# EAGLE design Hi Tension VGA Modulator (EAGLE 9.0.0)
CNAME: otsos.net; CREVISION: 2; DESIGNER: Otso Sorvettula
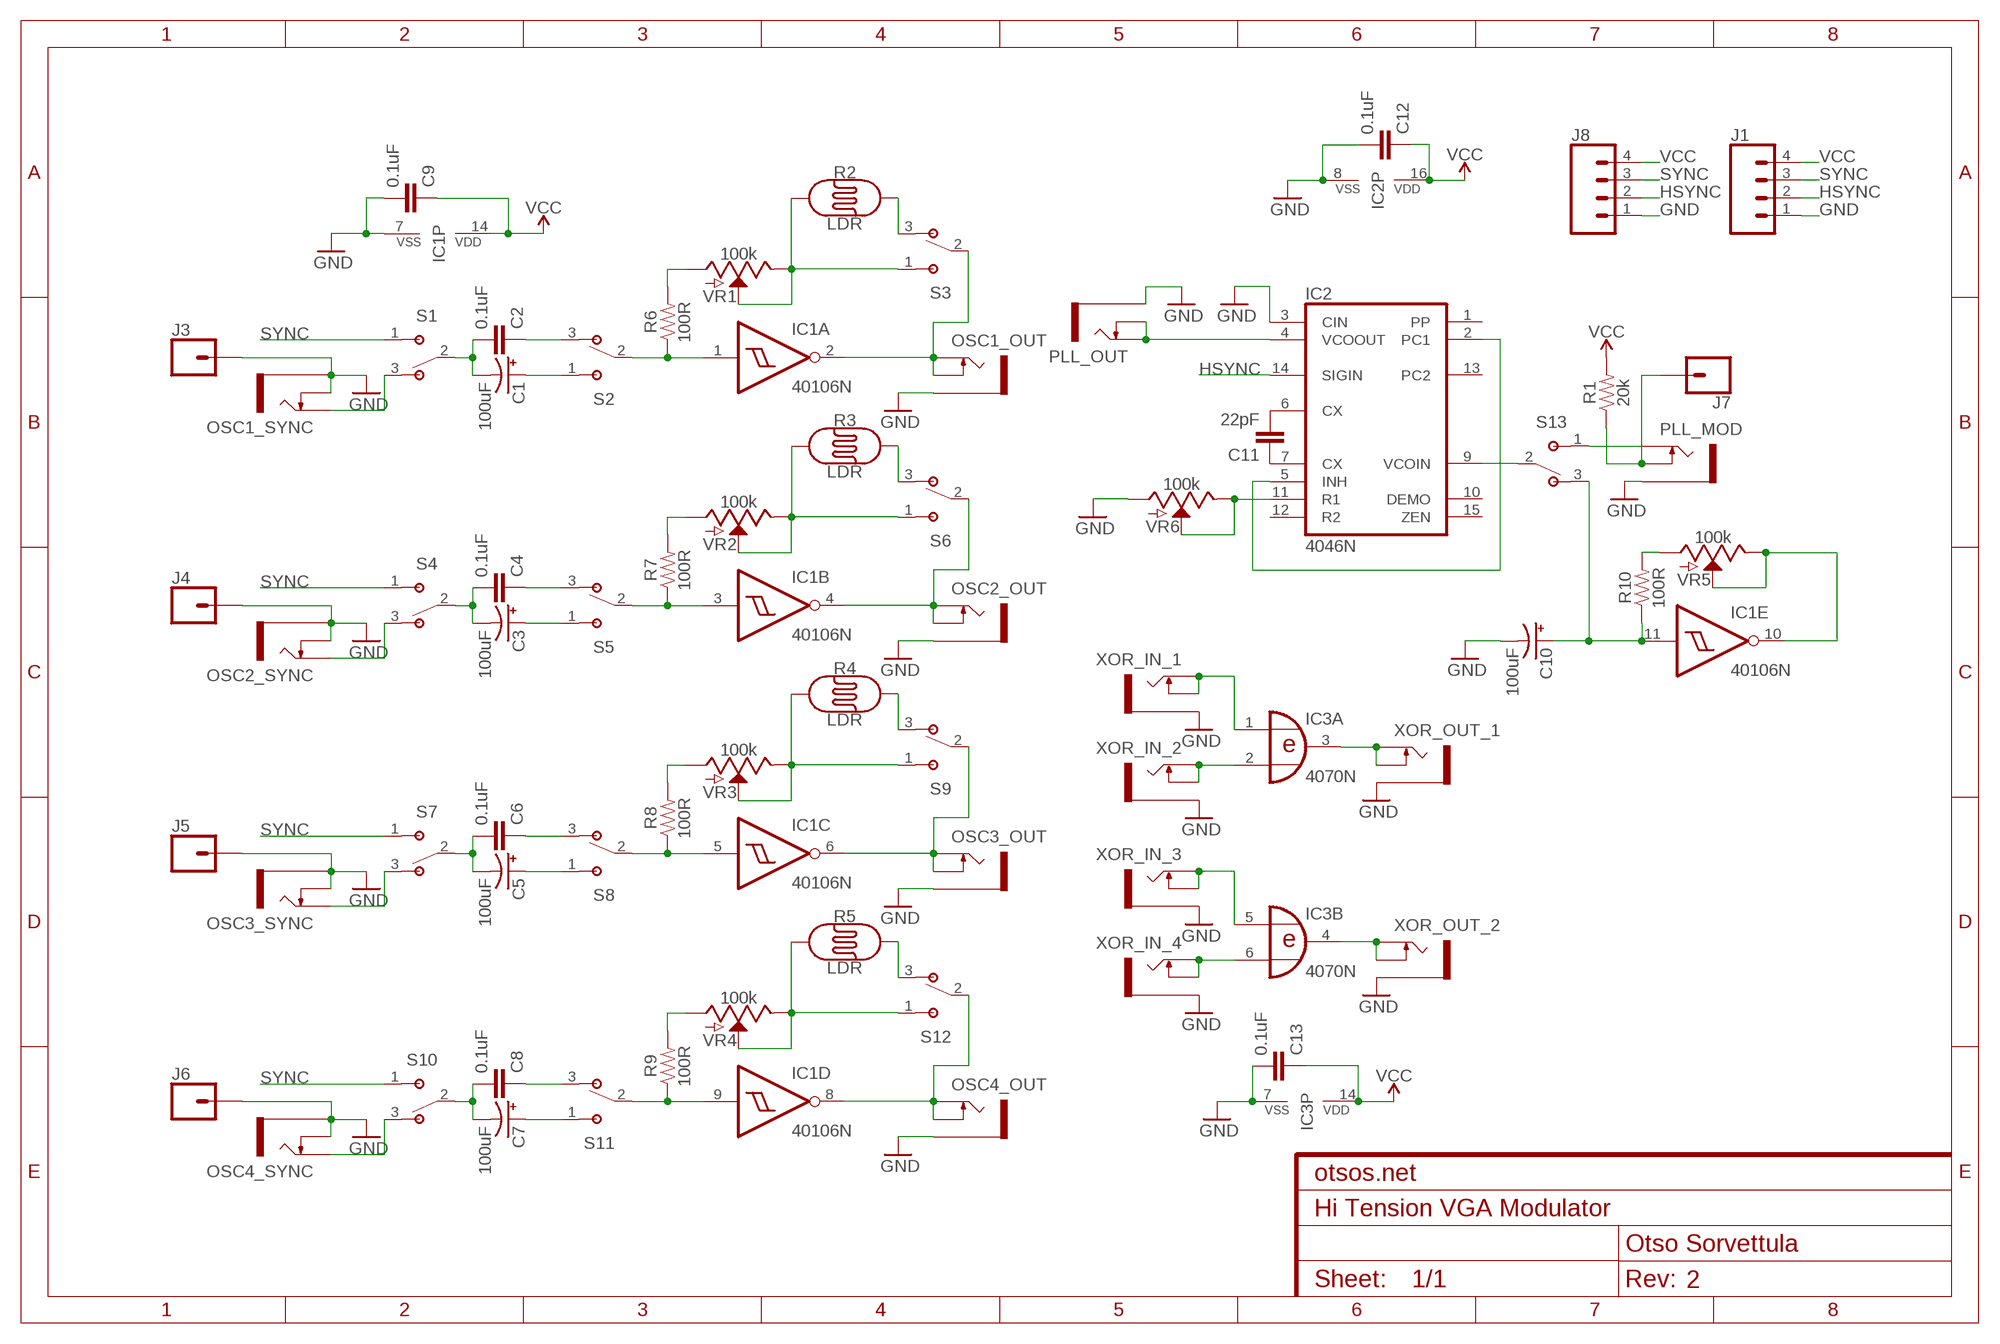
[diagram p0: schematic, sheet 1]

## Parts
C1  100uF  100UF-POLAR-RADIAL-2.5MM-25V-20%  [CPOL-RADIAL-2.5MM-6.5MM]
C2  0.1uF  C-EU025-025X050  [C025-025X050]
C3  100uF  100UF-POLAR-RADIAL-2.5MM-25V-20%  [CPOL-RADIAL-2.5MM-6.5MM]
C4  0.1uF  C-EU025-025X050  [C025-025X050]
C5  100uF  100UF-POLAR-RADIAL-2.5MM-25V-20%  [CPOL-RADIAL-2.5MM-6.5MM]
C6  0.1uF  C-EU025-025X050  [C025-025X050]
C7  100uF  100UF-POLAR-RADIAL-2.5MM-25V-20%  [CPOL-RADIAL-2.5MM-6.5MM]
C8  0.1uF  C-EU025-025X050  [C025-025X050]
C9  0.1uF  C-EU025-025X050  [C025-025X050]
C10  100uF  100UF-POLAR-RADIAL-2.5MM-25V-20%  [CPOL-RADIAL-2.5MM-6.5MM]
C11  22pF  22PF-PTH-2.54MM-200V-5%  [CAP-PTH-2.54]
C12  0.1uF  C-EU025-025X050  [C025-025X050]
C13  0.1uF  C-EU025-025X050  [C025-025X050]
IC1  40106N  [DIL14]
IC2  4046N  [DIL16]
IC3  4070N  [DIL14]
J1  CONN_04  [1X04]
J3  CONN_01PTH_NO_SILK_YES_STOP  [1X01_NO_SILK]
J4  CONN_01PTH_NO_SILK_YES_STOP  [1X01_NO_SILK]
J5  CONN_01PTH_NO_SILK_YES_STOP  [1X01_NO_SILK]
J6  CONN_01PTH_NO_SILK_YES_STOP  [1X01_NO_SILK]
J7  CONN_01PTH_NO_SILK_YES_STOP  [1X01_NO_SILK]
J8  CONN_04  [1X04]
OSC1_OUT  THONKICONNNEW  [WQP-PJ301M-12_JACK]
OSC1_SYNC  THONKICONNNEW  [WQP-PJ301M-12_JACK]
OSC2_OUT  THONKICONNNEW  [WQP-PJ301M-12_JACK]
OSC2_SYNC  THONKICONNNEW  [WQP-PJ301M-12_JACK]
OSC3_OUT  THONKICONNNEW  [WQP-PJ301M-12_JACK]
OSC3_SYNC  THONKICONNNEW  [WQP-PJ301M-12_JACK]
OSC4_OUT  THONKICONNNEW  [WQP-PJ301M-12_JACK]
OSC4_SYNC  THONKICONNNEW  [WQP-PJ301M-12_JACK]
PLL_MOD  THONKICONNNEW  [WQP-PJ301M-12_JACK]
PLL_OUT  THONKICONNNEW  [WQP-PJ301M-12_JACK]
R1  20k  1KOHM-HORIZ-1/4W-1%  [AXIAL-0.3]
R2  LDR  PHOTOCELLPTH  [PHOTOCELL]
R3  LDR  PHOTOCELLPTH  [PHOTOCELL]
R4  LDR  PHOTOCELLPTH  [PHOTOCELL]
R5  LDR  PHOTOCELLPTH  [PHOTOCELL]
R6  100R  1KOHM-HORIZ-1/4W-1%  [AXIAL-0.3]
R7  100R  1KOHM-HORIZ-1/4W-1%  [AXIAL-0.3]
R8  100R  1KOHM-HORIZ-1/4W-1%  [AXIAL-0.3]
R9  100R  1KOHM-HORIZ-1/4W-1%  [AXIAL-0.3]
R10  100R  1KOHM-HORIZ-1/4W-1%  [AXIAL-0.3]
S1  OS102011MS2QN1  [SW_OS102011MS2QN1]
S2  OS102011MS2QN1  [SW_OS102011MS2QN1]
S3  OS102011MS2QN1  [SW_OS102011MS2QN1]
S4  OS102011MS2QN1  [SW_OS102011MS2QN1]
S5  OS102011MS2QN1  [SW_OS102011MS2QN1]
S6  OS102011MS2QN1  [SW_OS102011MS2QN1]
S7  OS102011MS2QN1  [SW_OS102011MS2QN1]
S8  OS102011MS2QN1  [SW_OS102011MS2QN1]
S9  OS102011MS2QN1  [SW_OS102011MS2QN1]
S10  OS102011MS2QN1  [SW_OS102011MS2QN1]
S11  OS102011MS2QN1  [SW_OS102011MS2QN1]
S12  OS102011MS2QN1  [SW_OS102011MS2QN1]
S13  OS102011MS2QN1  [SW_OS102011MS2QN1]
VR1  100k  POTENTIOMETER-PTH-9MM-1/20W-20%  [POT-PTH-ALPS]
VR2  100k  POTENTIOMETER-PTH-9MM-1/20W-20%  [POT-PTH-ALPS]
VR3  100k  POTENTIOMETER-PTH-9MM-1/20W-20%  [POT-PTH-ALPS]
VR4  100k  POTENTIOMETER-PTH-9MM-1/20W-20%  [POT-PTH-ALPS]
VR5  100k  POTENTIOMETER-PTH-9MM-1/20W-20%  [POT-PTH-ALPS]
VR6  100k  POTENTIOMETER-PTH-9MM-1/20W-20%  [POT-PTH-ALPS]
XOR_IN_1  THONKICONNNEW  [WQP-PJ301M-12_JACK]
XOR_IN_2  THONKICONNNEW  [WQP-PJ301M-12_JACK]
XOR_IN_3  THONKICONNNEW  [WQP-PJ301M-12_JACK]
XOR_IN_4  THONKICONNNEW  [WQP-PJ301M-12_JACK]
XOR_OUT_1  THONKICONNNEW  [WQP-PJ301M-12_JACK]
XOR_OUT_2  THONKICONNNEW  [WQP-PJ301M-12_JACK]

## Nets
GND: C9.2 C10.2(-) C12.2 C13.2 IC1.7(P:VSS) IC2.3(CIN) IC2.8(VSS) IC3.7(P:VSS) J1.1 J3.1 J4.1 J5.1 J6.1 J8.1 OSC1_OUT.P$3_SLEEVE(SLEEVE) OSC1_SYNC.P$2_SWITCH(SWITCH) OSC1_SYNC.P$3_SLEEVE(SLEEVE) OSC2_OUT.P$3_SLEEVE(SLEEVE) OSC2_SYNC.P$2_SWITCH(SWITCH) OSC2_SYNC.P$3_SLEEVE(SLEEVE) OSC3_OUT.P$3_SLEEVE(SLEEVE) OSC3_SYNC.P$2_SWITCH(SWITCH) OSC3_SYNC.P$3_SLEEVE(SLEEVE) OSC4_OUT.P$3_SLEEVE(SLEEVE) OSC4_SYNC.P$2_SWITCH(SWITCH) OSC4_SYNC.P$3_SLEEVE(SLEEVE) PLL_MOD.P$3_SLEEVE(SLEEVE) PLL_OUT.P$3_SLEEVE(SLEEVE) VR6.P$3(A) XOR_IN_1.P$3_SLEEVE(SLEEVE) XOR_IN_2.P$3_SLEEVE(SLEEVE) XOR_IN_3.P$3_SLEEVE(SLEEVE) XOR_IN_4.P$3_SLEEVE(SLEEVE) XOR_OUT_1.P$3_SLEEVE(SLEEVE) XOR_OUT_2.P$3_SLEEVE(SLEEVE)
HSYNC: IC2.14(SIGIN) J1.2 J8.2
N$1: OSC1_SYNC.P$1_TIP(TIP) S1.3
N$2: C1.2(-) C2.2 S1.2
N$3: C2.1 S2.3
N$4: C1.1(+) S2.1
N$5: IC1.1(A:I) R6.P$1 S2.2
N$6: R10.P$2 VR5.P$3(A)
N$7: R2.1 S3.1 VR1.P$1(E) VR1.P$2(S)
N$8: IC1.2(A:O) OSC1_OUT.P$1_TIP(TIP) OSC1_OUT.P$2_SWITCH(SWITCH) S3.2
N$9: OSC2_SYNC.P$1_TIP(TIP) S4.3
N$10: C3.2(-) C4.2 S4.2
N$11: C3.1(+) S5.1
N$12: IC1.3(B:I) R7.P$1 S5.2
N$13: R2.2 S3.3
N$15: IC1.4(B:O) OSC2_OUT.P$1_TIP(TIP) OSC2_OUT.P$2_SWITCH(SWITCH) S6.2
N$16: C4.1 S5.3
N$17: OSC3_SYNC.P$1_TIP(TIP) S7.3
N$18: C5.2(-) C6.2 S7.2
N$19: C5.1(+) S8.1
N$20: IC1.5(C:I) R8.P$1 S8.2
N$21: R3.2 S6.3
N$22: R5.2 S12.3
N$23: IC1.6(C:O) OSC3_OUT.P$1_TIP(TIP) OSC3_OUT.P$2_SWITCH(SWITCH) S9.2
N$24: C6.1 S8.3
N$25: OSC4_SYNC.P$1_TIP(TIP) S10.3
N$26: C7.2(-) C8.2 S10.2
N$27: C8.1 S11.3
N$28: IC1.9(D:I) R9.P$1 S11.2
N$29: R4.1 S9.1 VR3.P$1(E) VR3.P$2(S)
N$31: IC1.8(D:O) OSC4_OUT.P$1_TIP(TIP) OSC4_OUT.P$2_SWITCH(SWITCH) S12.2
N$32: C7.1(+) S11.1
N$33: C11.1 IC2.7(CX)
N$34: C11.2 IC2.6(CX)
N$35: IC2.9(VCOIN) S13.2
N$36: PLL_MOD.P$1_TIP(TIP) S13.1
N$37: IC2.2(PC1) IC2.5(INH)
N$38: IC2.4(VCOOUT) PLL_OUT.P$1_TIP(TIP) PLL_OUT.P$2_SWITCH(SWITCH)
N$39: J7.1 PLL_MOD.P$2_SWITCH(SWITCH) R1.P$1
N$40: C10.1(+) IC1.11(E:I) R10.P$1 S13.3
N$41: IC1.10(E:O) VR5.P$1(E) VR5.P$2(S)
N$42: IC3.5(B:I0) XOR_IN_3.P$1_TIP(TIP) XOR_IN_3.P$2_SWITCH(SWITCH)
N$43: IC2.11(R1) VR6.P$1(E) VR6.P$2(S)
N$44: IC3.1(A:I0) XOR_IN_1.P$1_TIP(TIP) XOR_IN_1.P$2_SWITCH(SWITCH)
N$45: IC3.2(A:I1) XOR_IN_2.P$1_TIP(TIP) XOR_IN_2.P$2_SWITCH(SWITCH)
N$46: IC3.6(B:I1) XOR_IN_4.P$1_TIP(TIP) XOR_IN_4.P$2_SWITCH(SWITCH)
N$47: IC3.3(A:O) XOR_OUT_1.P$1_TIP(TIP) XOR_OUT_1.P$2_SWITCH(SWITCH)
N$48: IC3.4(B:O) XOR_OUT_2.P$1_TIP(TIP) XOR_OUT_2.P$2_SWITCH(SWITCH)
N$49: R4.2 S9.3
N$50: R3.1 S6.1 VR2.P$1(E) VR2.P$2(S)
N$52: R5.1 S12.1 VR4.P$1(E) VR4.P$2(S)
N$54: R6.P$2 VR1.P$3(A)
N$55: R7.P$2 VR2.P$3(A)
N$56: R8.P$2 VR3.P$3(A)
N$57: R9.P$2 VR4.P$3(A)
SYNC: J1.3 J8.3 S1.1 S4.1 S7.1 S10.1
VCC [VCC]: C9.1 C12.1 C13.1 IC1.14(P:VDD) IC2.16(VDD) IC3.14(P:VDD) J1.4 J8.4 R1.P$2
Unconnected: IC1.12(F:O) IC1.13(F:I) IC2.1(PP) IC2.10(DEMO) IC2.12(R2) IC2.13(PC2) IC2.15(ZEN) IC3.8(C:I0) IC3.9(C:I1) IC3.10(C:O) IC3.11(D:O) IC3.12(D:I0) IC3.13(D:I1)

## Library data of the parts
C1 C3 C5 C7 C10 = SparkFun-Capacitors:100UF-POLAR: 100µF polarized capacitors A capacitor is a passive two-terminal electrical component used to store electrical energy temporarily in an electric field.; PROD_ID: CAP-08439
C2 C4 C6 C8 C9 C12 C13 = rcl:C-EU: CAPACITOR, European symbol; SPICEPREFIX: C
C11 = SparkFun-Capacitors:22PF: 22pF ceramic capacitors A capacitor is a passive two-terminal electrical component used to store electrical energy temporarily in an electric field.; PROD_ID: CAP-09128
IC1 = 40xx:40106: Hex SCHMITT TRIGGER
IC2 = 40xx:4046: Micropower PLL
IC3 = 40xx:4070: Quad 2-input XOR
J1 J8 = SparkFun-Connectors:CONN_04: Multi connection point. Often used as Generic Header-pin footprint for 0.1 inch spaced/style header connections On any of the 0.1 inch spaced packages, you can populate with these: Break Away Headers - Straight <https://www.sparkfun.com/products/116> (PRT-00116) Break Away Male Headers - Right Angle <https://www.sparkfun.com/products/553> (PRT-00553) Female Headers <https://www.sparkfun.com/products/115> (PRT-00115) Break Away Headers - Machine Pin <https://www.sparkfun.com/products/117> (PRT-00117) Break Away Female Headers - Swiss Machine Pin <https://www.sparkfun.com/products/743> (PRT-00743) For SCREWTERMINALS and SPRING TERMINALS visit here: Screw Terimnals on SparkFun.com <https://www.sparkfun.com/search/results?term=Screw+Terminals> (5mm/3.5mm/2.54mm spacing) This device is also useful as a general connection point to wire up your design to another part of your project. Our various solder wires solder well into these plated through hole pads. Hook-Up Wire - Assortment (Stranded, 22 AWG) <https://www.sparkfun.com/products/11375> (PRT-11375) Hook-Up Wire - Assortment (Solid Core, 22 AWG) <https://www.sparkfun.com/products/11367> (PRT-11367) View the entire wire category on our website here <https://www.sparkfun.com/categories/141> Special notes: Molex polarized connector foot print use with SKU : PRT-08231 with associated crimp pins and housings. 1MM SMD Version SKU: PRT-10208; PROD_ID: CONN-09696
J3-J7 = SparkFun-Connectors:CONN_01: Single connection point. Often used as Generic Header-pin footprint for 0.1 inch spaced/style header connections On any of the 0.1 inch spaced packages, you can populate with these: Break Away Headers - Straight <https://www.sparkfun.com/products/116> (PRT-00116) Break Away Male Headers - Right Angle <https://www.sparkfun.com/products/553> (PRT-00553) Female Headers <https://www.sparkfun.com/products/115> (PRT-00115) Break Away Headers - Machine Pin <https://www.sparkfun.com/products/117> (PRT-00117) Break Away Female Headers - Swiss Machine Pin <https://www.sparkfun.com/products/743> (PRT-00743) This device is also useful as a general connection point to wire up your design to another part of your project. Our various solder wires solder well into these plated through hole pads. Hook-Up Wire - Assortment (Stranded, 22 AWG) <https://www.sparkfun.com/products/11375> (PRT-11375) Hook-Up Wire - Assortment (Solid Core, 22 AWG) <https://www.sparkfun.com/products/11367> (PRT-11367) View the entire wire category on our website here <https://www.sparkfun.com/categories/141> Special notes: SMTSO-256-ET is a "flush mount" nut for a 4-40 screw. We mostly use this on specialty testbeds; it is a nice way to connect hardware to your PCB at an adjustable hieght. Also note, the SNAP packages are for using a snappable style connector. We sell a baggie of snaps and they are also used on two LilyPad designs: Snap Assortment - 30 pack (male and female) <https://www.sparkfun.com/products/11347> (DEV-11347) LilyPad Arduino SimpleSnap <https://www.sparkfun.com/products/10941> (DEV-10941) LilyPad SimpleSnap Protoboard <https://www.sparkfun.com/products/10940> (DEV-10940)
OSC1_OUT OSC1_SYNC OSC2_OUT OSC2_SYNC OSC3_OUT OSC3_SYNC OSC4_OUT OSC4_SYNC PLL_MOD PLL_OUT XOR_IN_1-XOR_IN_4 XOR_OUT_1 XOR_OUT_2 = MusicThingModular:THONKICONN: 3.5mm socket for Eurorack modular synths
R1 R6-R10 = SparkFun-Resistors:1KOHM: 1kΩ resistor A resistor is a passive two-terminal electrical component that implements electrical resistance as a circuit element. Resistors act to reduce current flow, and, at the same time, act to lower voltage levels within circuits. - Wikipedia; PROD_ID: RES-12182; VALUE: 1k
R2-R5 = SparkFun-Sensors:PHOTOCELL: Photocell (Photodetector, Photo Resistor, CdS) This is a very small light sensor. A photocell changes (also called a photodetector, photo resistor, CdS or photoconductive cell) resistance depending on the amount of light it is exposed to. These little sensors make great ambient light triggers (when light in the room turns on, do something). Datasheet <http://cdn.sparkfun.com/datasheets/Sensors/LightImaging/SEN-09088.pdf> SparkFun Products Mini Photocell <https://www.sparkfun.com/products/9088> (SEN-09088); PROD_ID: COMP-09129; SF_ID: SEN-09088
S1-S13 = OS102011MS2QN1:OS102011MS2QN1: Switch Slide ON ON SPDT Top Slide 0.1A 12VDC 10000Cycles PC Pins Thru-Hole Bulk; AVAILABILITY: Unavailable; DESCRIPTION: Switch Slide ON ON SPDT Top Slide 0.1A 12VDC 10000Cycles PC Pins Thru-Hole Bulk; MF: C&K; MP: OS102011MS2QN1; PACKAGE: DO-201 C&amp;K Components; PRICE: None
VR1-VR6 = SparkFun-Resistors:POTENTIOMETER: Potentiometer (Pot) Three-terminal potentiometers, with an adjustable wiper and two adjustable resistors. A pot can be used to create a configurable voltage divider, or as a variable resistor. Variants ALPS_POT and ALPS_POT_KIT - PTH, breadboard compatible, 9mm square pots Rotary Potentiometer - Linear (10k ohm) <https://www.sparkfun.com/products/9288> (COM-09288) The KIT variant exposes copper on only one side of the PTH pad, so the part can only be assembled on one side of the PCB. Useful for beginner soldering kits.; PROD_ID: RES-09177; SF_SKU: COM-09288; VALUE: 10k

## Net classes
0 default: width 0.254 mm, clearance 0.254 mm
1 VCC: width 0.508 mm, clearance 0.508 mm
2 GND: width 0.508 mm, clearance 0.508 mm

## Board
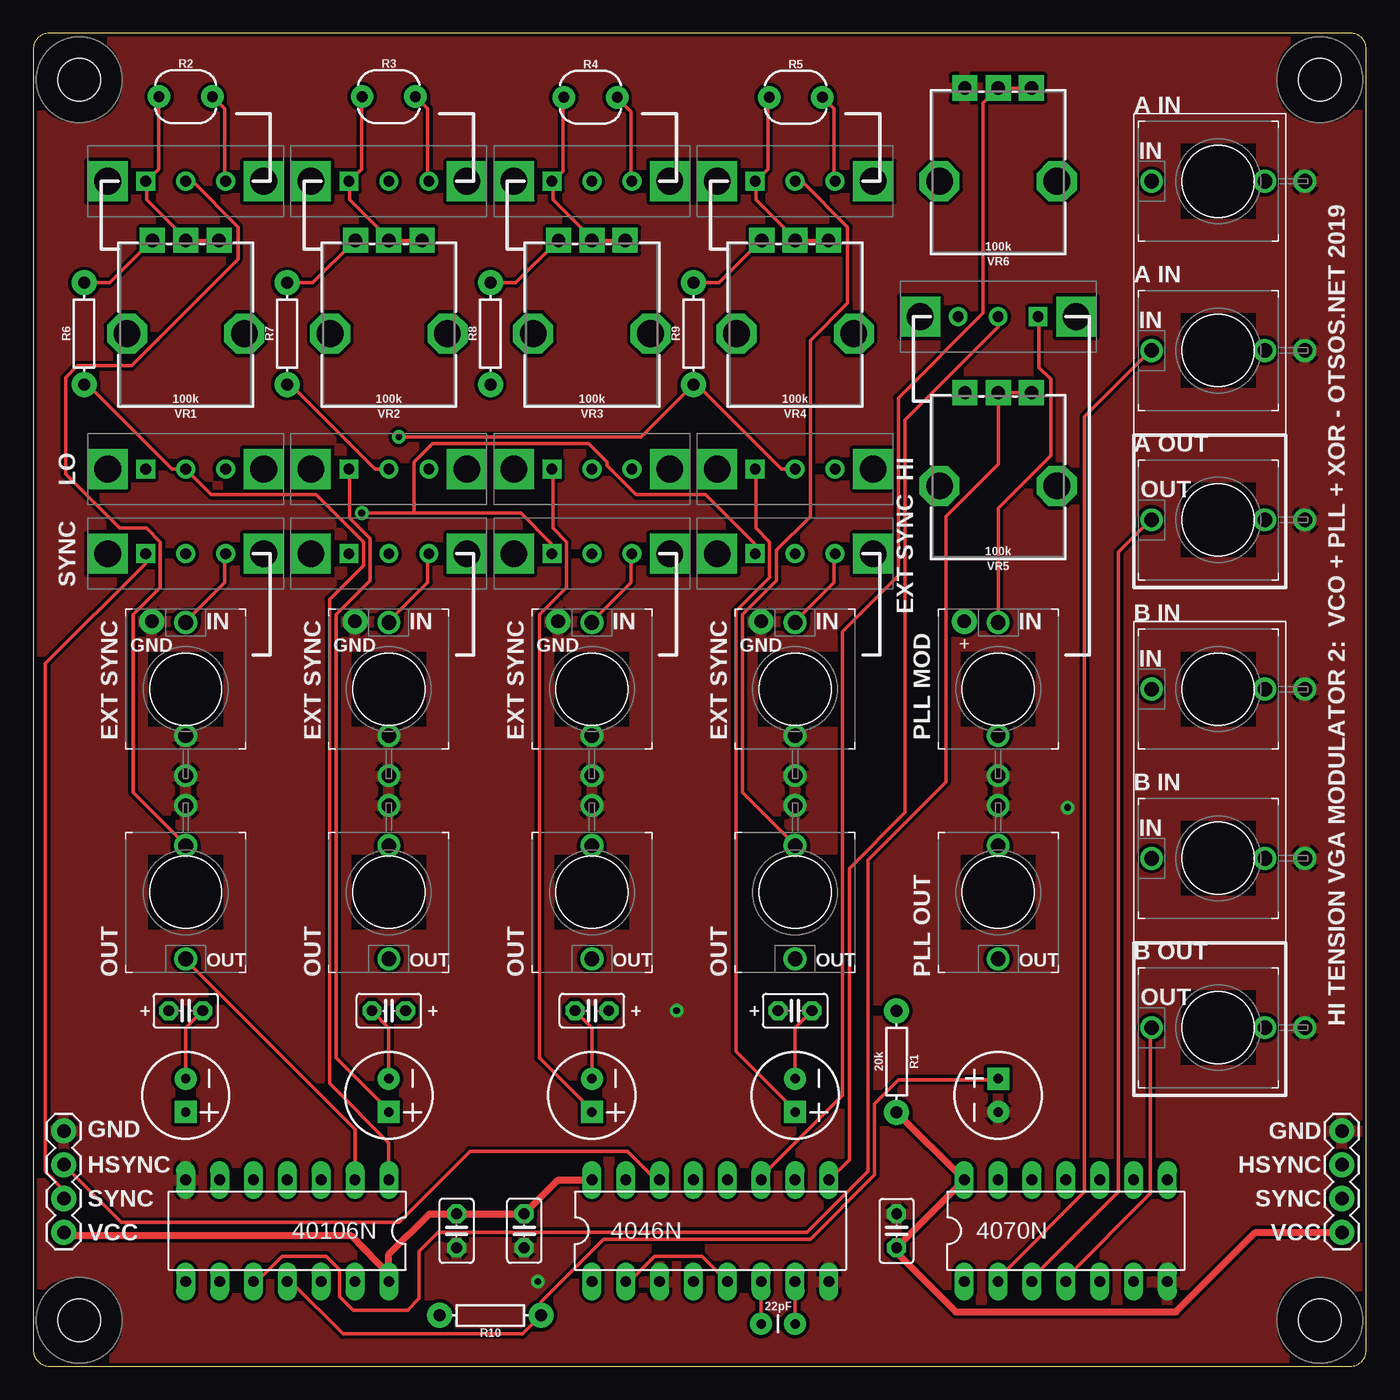
[diagram p1: board, top side]
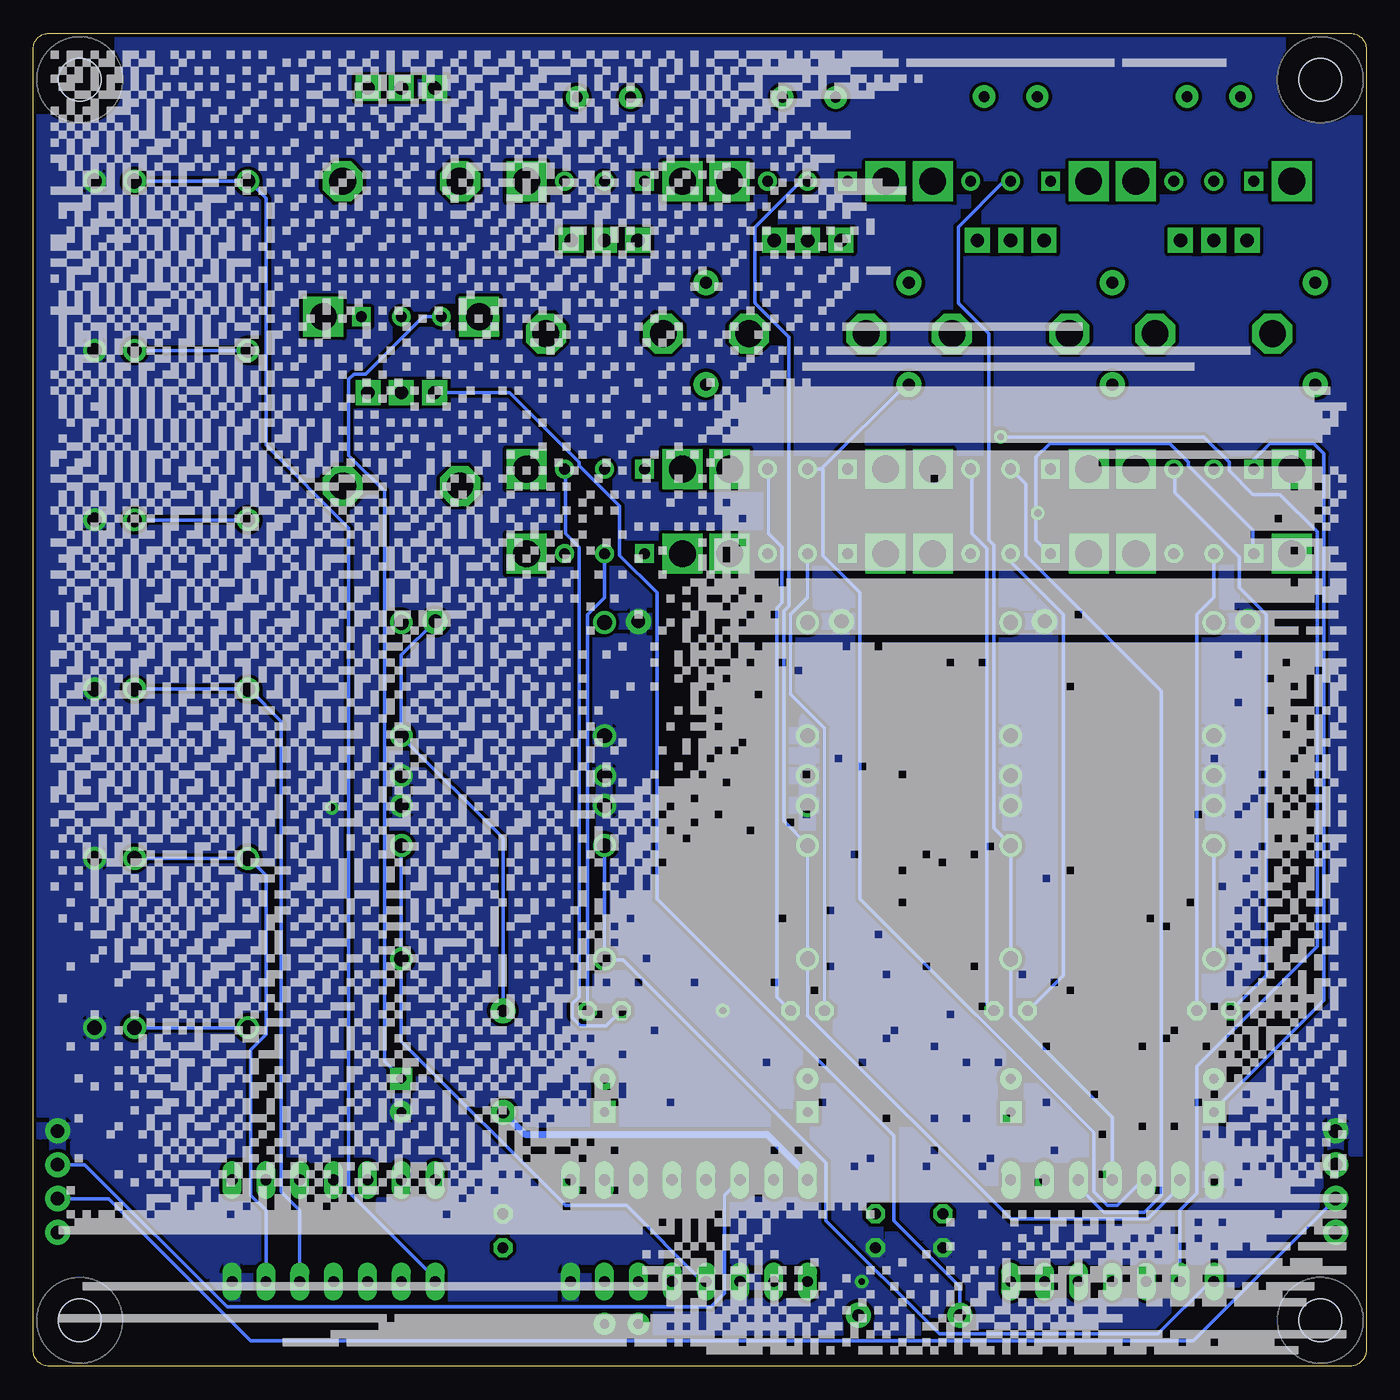
[diagram p2: board, bottom side, seen from below]

Size 100 x 100 mm. Coordinates in mm from the lower left corner, seen from the top.
Outline: 98.83,100 1.19,100 arc90 0,98.81 0,1.21 arc90 1.21,0 98.81,0 arc90 100,1.19 100,98.83 arc90 98.83,100
Copper layers (1*16): Top 0.035mm / dielectric 1.5mm / Bottom 0.035mm
Design rules "SparkFun": minimum track width 8mil, minimum drill 20mil, track to track 8mil, track to pad 8mil, pad to pad 8mil, via to via 8mil, smd to smd 8mil, copper to edge 10mil, drill to drill 8mil, minimum pad ring 12mil, minimum via ring 10mil, stop-mask expansion 4mil, vias tented up to drill 25mil, thermal gap 10mil

### Footprints (pad centres in the part's own frame; a part is rotated, then mirrored left to right if it is on the bottom)
CPOL-RADIAL-2.5MM-6.5MM = drill 0.7 pad 1.651 square: 1 1.25,0 | drill 0.7 pad 1.651: 2 -1.25,0
C025-025X050 = drill 0.813 octagon: 1 -1.27,0; 2 1.27,0
CAP-PTH-2.54 = drill 0.7 pad 1.651: 1 -1.27,0; 2 1.27,0
DIL14 = drill 0.813 long: 1 -7.62,-3.81; 2 -5.08,-3.81; 3 -2.54,-3.81; 4 0,-3.81; 5 2.54,-3.81; 6 5.08,-3.81; 7 7.62,-3.81; 8 7.62,3.81; 9 5.08,3.81; 10 2.54,3.81; 11 0,3.81; 12 -2.54,3.81; 13 -5.08,3.81; 14 -7.62,3.81
DIL16 = drill 0.813 long: 1 -8.89,-3.81; 2 -6.35,-3.81; 3 -3.81,-3.81; 4 -1.27,-3.81; 5 1.27,-3.81; 6 3.81,-3.81; 7 6.35,-3.81; 8 8.89,-3.81; 9 8.89,3.81; 10 6.35,3.81; 11 3.81,3.81; 12 1.27,3.81; 13 -1.27,3.81; 14 -3.81,3.81; 15 -6.35,3.81; 16 -8.89,3.81
1X04 = drill 1.016 pad 1.88: 1 0,0; 2 2.54,0; 3 5.08,0; 4 7.62,0
1X01_NO_SILK = drill 1.016 pad 1.88: 1 0,0
WQP-PJ301M-12_JACK = drill 1.1: P$1_TIP 0,5; P$2_SWITCH 0,-3.5; P$3_SLEEVE 0,-6.5
AXIAL-0.3 = drill 0.9 pad 1.88: P$1 -3.81,0; P$2 3.81,0
PHOTOCELL = drill 0.8 pad 1.676: 1 -2,0; 2 2,0
SW_OS102011MS2QN1 = drill 0.8 square: 1 -3,0 | drill 0.8: 2 0,0; 3 3,0 | drill 2 pad 2.54 square: P$1 5.85,0; P$2 -5.85,0
MOUNTING_HOLE = hole 3.2: 0,0
POT-PTH-ALPS = drill 1 pad 1.88 square: P$1 7,-2.5; P$2 7,0; P$3 7,2.5 | drill 2 octagon: P$4 0,-4.4; P$5 0,4.4

### Placement (x,y rotation side)
C1  11.43,20.32 270 top
C2  11.43,26.67 0 top
C3  26.67,20.32 270 top
C4  26.67,26.67 180 top
C5  41.91,20.32 270 top
C6  41.91,26.67 180 top
C7  57.15,20.32 270 top
C8  57.15,26.67 0 top
C9  31.75,10.16 270 top
C10  72.39,20.32 90 top
C11  55.88,3.17 180 top
C12  36.83,10.16 270 top
C13  64.77,10.16 90 top
IC1  19.05,10.16 180 top
IC2  50.8,10.16 0 top
IC3  77.47,10.16 0 top
J1  98.17,17.65 270 top
J3  8.89,55.88 0 top
J4  24.13,55.88 0 top
J5  39.37,55.88 0 top
J6  54.61,55.88 0 top
J7  69.85,55.88 0 top
J8  2.29,17.65 270 top
OSC1_OUT  11.43,35.56 180 top
OSC1_SYNC  11.43,50.8 0 top
OSC2_OUT  26.67,35.56 180 top
OSC2_SYNC  26.67,50.8 0 top
OSC3_OUT  41.91,35.56 180 top
OSC3_SYNC  41.91,50.8 0 top
OSC4_OUT  57.15,35.56 180 top
OSC4_SYNC  57.15,50.8 0 top
PLL_MOD  72.39,50.8 0 top
PLL_OUT  72.39,35.56 180 top
R1  64.77,22.86 270 top
R2  11.43,95.25 0 top
R3  26.67,95.25 0 top
R4  41.8,95.2 0 top
R5  57.2,95.2 0 top
R6  3.81,77.47 90 top
R7  19.05,77.47 90 top
R8  34.29,77.47 90 top
R9  49.53,77.47 90 top
R10  34.29,3.81 180 top
S1  11.43,60.96 0 top
S2  11.43,67.31 0 top
S3  11.43,88.9 0 top
S4  26.67,60.96 0 top
S5  26.67,67.31 0 top
S6  26.67,88.9 0 top
S7  41.91,60.96 0 top
S8  41.91,67.31 0 top
S9  41.91,88.9 0 top
S10  57.15,60.96 0 top
S11  57.15,67.31 0 top
S12  57.15,88.9 0 top
S13  72.39,78.74 180 top
U$1  [MOUNTING_HOLE]  3.43,96.52 0 top
U$2  [MOUNTING_HOLE]  96.52,96.52 0 top
U$3  [MOUNTING_HOLE]  96.52,3.43 0 top
U$4  [MOUNTING_HOLE]  3.43,3.43 0 top
VR1  11.43,77.47 90 top
VR2  26.67,77.47 90 top
VR3  41.91,77.47 90 top
VR4  57.15,77.47 90 top
VR5  72.39,66.04 90 top
VR6  72.39,88.9 90 top
XOR_IN_1  88.9,88.9 90 top
XOR_IN_2  88.9,76.2 90 top
XOR_IN_3  88.9,50.8 90 top
XOR_IN_4  88.9,38.1 90 top
XOR_OUT_1  88.9,63.5 90 top
XOR_OUT_2  88.9,25.4 90 top

### Tracks (layer width: path | path; a pad name or v marks a point on that pad's centre or on a via)
GND  (via drill 0.51)
  other vias: 37.85,6.35 77.6,41.91 48.26,26.67
  pour Bottom: 0,100.33 0,0 100.33,0 100.33,100.33
  pour Top: 0,100.33 0,0 100.33,0 100.33,100.33
HSYNC
  Top 0.254: IC2.14 46.74,13.97 44.58,16.13 32.77,16.13 27.43,10.79 6.6,10.79 J8.2
  Bottom 0.254: J1.2 96.14,15.11 85.47,4.45 49.15,4.45 48.13,5.46 48.13,12.83 IC2.14
N$1
  Top 0.254: S1.3 14.35,60.96 14.35,58.8 11.43,55.88 OSC1_SYNC.P$1_TIP
N$2
  Top 0.254: C1.2 11.43,25.4 C2.2
  Bottom 0.254: S1.2 11.43,57.66 12.7,56.39 C2.2
N$3
  Bottom 0.254: C2.1 7.49,29.34 7.49,56.39 9.53,58.42 9.53,60.71 14.35,65.53 14.35,67.31 S2.3
N$4
  Bottom 0.254: S2.1 8.38,67.31 8.38,68.07 7.24,69.22 3.94,69.22 3.17,68.45 3.17,27.43 11.43,19.18 C1.1
N$5
  Top 0.254: R6.P$1 4.06,73.66 10.41,67.31 S2.2 13.34,65.41 21.21,65.41 24.77,61.85 24.77,60.07 22.23,57.53 22.23,21.21 26.67,16.76 IC1.1
N$6
  Bottom 0.254: R10.P$2 30.48,5.97 35.43,10.92 35.43,17.27 53.21,35.05 53.21,58.04 56.01,60.83 56.01,64.52 59.05,67.56 59.05,67.82 64.26,73.03 69.85,73.03 VR5.P$3
N$7
  Top 0.254: 8.51,88.9 8.51,87.5 11.43,84.58 VR1.P$2 11.43,84.45 13.84,84.45 VR1.P$1 | 8.51,88.9 9.4,89.79 9.4,95.25 R2.1 | 8.51,88.9 S3.1
N$8
  Top 0.254: IC1.2 24.13,17.78 11.43,30.48 OSC1_OUT.P$1_TIP | S3.2 11.94,88.9 15.37,85.47 15.37,83.06 7.37,75.06 3.3,75.06 2.41,74.17 2.41,66.93 6.48,62.87 8.51,62.87 9.53,61.85 9.53,58.42 7.49,56.39 7.49,43.05 11.43,39.12 OSC1_OUT.P$2_SWITCH
  Bottom 0.254: OSC1_OUT.P$2_SWITCH OSC1_OUT.P$1_TIP
N$9
  Top 0.254: S4.3 29.59,60.96 29.59,58.8 26.67,55.88 OSC2_SYNC.P$1_TIP
N$10
  Top 0.254: C3.2 26.67,25.4 C4.2
  Bottom 0.254: S4.2 26.67,60.33 22.73,56.39 22.73,29.34 C4.2
N$11
  Top 0.254: S5.1 23.75,67.31 23.75,63.63 25.27,62.1 25.27,58.93 22.73,56.39 22.73,23.11 26.67,19.18 C3.1
N$12
  Top 0.254: S5.2 25.65,67.31 19.3,73.66 R7.P$1
  Bottom 0.254: IC1.3 21.59,13.46 19.68,11.56 16.64,11.56 15.37,12.83 15.37,50.67 25.53,60.83 25.53,66.17 S5.2
N$13
  Top 0.254: S3.3 14.35,88.9 14.35,94.36 13.46,95.25 R2.2
N$15
  Bottom 0.254: IC1.4 19.05,18.67 26.67,26.29 OSC2_OUT.P$1_TIP OSC2_OUT.P$2_SWITCH 26.67,39.12 27.94,40.39 27.94,61.59 28.32,61.98 28.32,77.47 30.61,79.76 30.61,85.47 27.18,88.9 S6.2
N$16
  Bottom 0.254: C4.1 28.45,27.18 28.45,61.34 29.59,62.48 29.59,67.31 S5.3
N$17
  Top 0.254: S7.3 44.83,60.96 44.83,58.8 41.91,55.88 OSC3_SYNC.P$1_TIP
N$18
  Top 0.254: C5.2 41.91,25.4 C6.2
  Bottom 0.254: S7.2 41.91,57.66 43.18,56.39 43.18,50.42 40.64,47.88 C6.2
N$19
  Top 0.254: S8.1 38.99,67.31 38.99,62.87 40.01,61.85 40.01,58.42 37.97,56.39 37.97,23.11 41.91,19.18 C5.1
N$20
  Bottom 0.254: S8.2 40.89,67.31 40.83,67.37 | 40.83,67.37 34.54,73.66 R8.P$1 | IC1.5 16.76,13.97 18.67,12.06 19.43,12.06 20.45,13.08 20.45,17.53 37.97,35.05 37.97,58.04 40.77,60.83 40.77,67.31 40.83,67.37
N$21
  Top 0.254: S6.3 29.59,88.9 29.59,94.36 28.7,95.25 R3.2
N$22
  Top 0.254: S12.3 60.07,88.9 60.07,94.36 59.31,95.12 R5.2
N$23
  Bottom 0.254: IC1.6 13.97,13.46 16.38,11.05 26.67,11.05 41.91,26.29 OSC3_OUT.P$1_TIP OSC3_OUT.P$2_SWITCH 41.91,39.12 43.69,40.89 43.69,56.64 43.31,57.02 43.31,77.22 45.85,79.76 45.85,85.47 42.42,88.9 S9.2
N$24
  Bottom 0.254: C6.1 44.2,27.69 44.2,56.9 43.81,57.28 43.81,61.47 44.83,62.48 44.83,67.31 S8.3
N$25
  Top 0.254: S10.3 60.07,60.96 60.07,58.8 57.15,55.88 OSC4_SYNC.P$1_TIP
N$26
  Top 0.254: C7.2 57.15,25.4 C8.2
  Bottom 0.254: S10.2 57.15,57.66 58.42,56.39 C8.2
N$27
  Bottom 0.254: C8.1 57.02,25.53 58.93,25.53 59.56,26.16 59.56,27.18 59.05,27.69 59.05,61.47 60.07,62.48 60.07,67.31 S11.3
N$28  (via drill 0.51)
  Top 0.254: S11.2 56.13,67.31 49.78,73.66 R9.P$1 45.59,69.72 v27.43,69.72
  Bottom 0.254: IC1.9 13.97,11.68 12.7,12.95 12.7,22.48 3.68,31.5 3.68,62.61 6.48,65.41 8.51,65.41 10.29,67.18 10.29,67.82 12.19,69.72 v27.43,69.72
N$29
  Top 0.254: 38.99,88.9 38.99,87.5 41.91,84.58 VR3.P$2 41.91,84.45 44.32,84.45 VR3.P$1 | 38.99,88.9 39.75,89.66 39.75,95.12 R4.1 | 38.99,88.9 S9.1
N$31
  Top 0.254: S12.2 57.66,88.9 61.09,85.47 61.09,79.76 58.29,76.96 58.29,63.75 55.75,61.21 55.75,58.93 53.21,56.39 53.21,43.05 57.15,39.12 OSC4_OUT.P$2_SWITCH
  Bottom 0.254: IC1.8 11.68,6.35 15.62,2.41 32,2.41 40.51,10.92 40.51,15.24 55.75,30.48 57.15,30.48 OSC4_OUT.P$1_TIP OSC4_OUT.P$2_SWITCH
N$32
  Top 0.254: S11.1 54.23,67.31 54.23,62.87 55.24,61.85 55.24,59.18 52.7,56.64 52.7,23.62 57.15,19.18 C7.1
N$33
  Top 0.254: C11.1 IC2.7
N$34
  Top 0.254: C11.2 IC2.6
N$35
  Top 0.254: S13.2 72.39,77.98 65.41,70.99 65.41,41.53 61.21,37.34 61.21,15.49 IC2.9
N$36
  Top 0.254: PLL_MOD.P$1_TIP 72.39,64.39 76.33,68.33 76.33,74.04 75.44,74.93 75.44,78.74 S13.1
N$37
  Top 0.254: IC2.2 44.7,6.35 46.61,8.26 50.16,8.26 IC2.5
N$38
  Bottom 0.254: IC2.4 49.78,6.35 55.5,12.06 60.07,12.06 72.39,24.38 PLL_OUT.P$1_TIP PLL_OUT.P$2_SWITCH
N$39
  Bottom 0.254: J7.1 72.39,53.34 PLL_MOD.P$2_SWITCH 72.39,47.24 64.77,39.62 R1.P$1
N$40
  Top 0.254: IC1.11 19.3,6.35 23.24,2.41 36.7,2.41 R10.P$1 38.1,4.83 42.8,9.53 58.29,9.53 63.12,14.35 63.12,19.68 64.9,21.46 72.39,21.46 C10.1
  Bottom 0.254: S13.3 70.74,78.74 75.06,74.42 75.95,74.42 76.33,74.04 76.33,68.33 73.66,65.66 73.66,22.86 72.39,21.59 C10.1
N$41
  Top 0.254: IC1.10 16.76,6.35 18.67,8.26 21.97,8.26 22.99,7.24 22.99,5.21 24,4.19 28.07,4.19 28.96,5.08 28.96,8.64 30.35,10.03 58.04,10.03 62.61,14.61 62.61,37.97 68.45,43.81 68.45,63.75 72.39,67.69 72.39,73.03 | 72.39,73.03 74.8,73.03 VR5.P$1 | 72.39,73.03 VR5.P$2
N$42
  Bottom 0.254: IC3.5 80.01,11.68 81.41,13.08 81.41,48.39 83.82,50.8 XOR_IN_3.P$1_TIP XOR_IN_3.P$2_SWITCH
N$43
  Top 0.254: IC2.11 54.61,14.22 60.71,20.32 60.71,55.12 64.9,59.31 64.9,72.64 71.25,78.99 71.25,94.74 72.39,95.89 | 72.39,95.89 74.8,95.89 VR6.P$1 | 72.39,95.89 VR6.P$2
N$44
  Bottom 0.254: IC3.1 69.85,6.6 76.33,13.08 76.33,62.87 82.55,69.09 82.55,87.63 83.82,88.9 XOR_IN_1.P$1_TIP XOR_IN_1.P$2_SWITCH
N$45
  Top 0.254: IC3.2 72.39,6.6 78.87,13.08 78.87,71.25 83.82,76.2 XOR_IN_2.P$1_TIP
  Bottom 0.254: XOR_IN_2.P$1_TIP XOR_IN_2.P$2_SWITCH
N$46
  Bottom 0.254: IC3.6 82.55,11.68 83.69,12.83 83.69,23.75 82.55,24.89 82.55,36.83 83.82,38.1 XOR_IN_4.P$1_TIP XOR_IN_4.P$2_SWITCH
N$47
  Top 0.254: IC3.3 74.93,6.6 81.41,13.08 81.41,61.09 83.82,63.5 XOR_OUT_1.P$1_TIP
  Bottom 0.254: XOR_OUT_1.P$1_TIP XOR_OUT_1.P$2_SWITCH
N$48
  Top 0.254: IC3.4 77.47,6.6 83.82,12.95 83.82,25.4 XOR_OUT_2.P$1_TIP
  Bottom 0.254: XOR_OUT_2.P$1_TIP XOR_OUT_2.P$2_SWITCH
N$49
  Top 0.254: S9.3 44.83,88.9 44.83,94.11 43.81,95.12 R4.2
N$50
  Top 0.254: 23.75,88.9 23.75,87.5 26.67,84.58 VR2.P$2 26.67,84.45 29.08,84.45 VR2.P$1 | 23.75,88.9 24.64,89.79 24.64,95.25 R3.1 | 23.75,88.9 S6.1
N$52
  Top 0.254: 54.23,88.9 54.23,87.5 57.15,84.58 VR4.P$2 57.15,84.45 59.56,84.45 VR4.P$1 | 54.23,88.9 55.12,89.79 55.12,95.12 R5.1 | 54.23,88.9 S12.1
N$54
  Top 0.254: R6.P$2 5.71,81.28 8.89,84.45 VR1.P$3
N$55
  Top 0.254: R7.P$2 20.95,81.28 24.13,84.45 VR2.P$3
N$56
  Top 0.254: R8.P$2 36.2,81.28 39.37,84.45 VR3.P$3
N$57
  Top 0.254: R9.P$2 51.44,81.28 54.61,84.45 VR4.P$3
SYNC  (via drill 0.51)
  Top 0.254: v24.64,64.01 28.57,64.01 | 28.57,64.01 36.58,64.01 38.86,61.72 38.86,60.96 S7.1 | 28.57,64.01 28.57,67.82 29.97,69.22 41.66,69.22 43.05,67.82 43.05,67.56 45.21,65.41 50.42,65.41 54.1,61.72 54.1,60.96 S10.1 | J8.3 2.29,13.21 0.89,14.61 0.89,52.7 8.38,60.2 8.38,60.96 S1.1
  Bottom 0.254: 24.77,64.01 24.77,61.98 23.75,60.96 S4.1 | 24.77,64.01 24.77,68.2 23.75,69.22 14.73,69.22 13.34,67.82 13.34,67.56 8.51,62.74 8.51,60.96 S1.1 | 24.77,64.01 v24.64,64.01 | J1.3 94.36,12.57 83.69,1.91 12.95,1.91 J8.3
VCC
  Top 0.508: IC2.16 39.37,13.97 C12.1 C9.1 29.72,11.43 26.67,8.38 IC1.14 26.8,6.73 23.88,9.78 2.54,9.78 J8.4 | R1.P$2 IC3.14 C13.1 64.9,8.76 64.9,8.38 69.22,4.06 85.72,4.06 91.69,10.03 J1.4
  Bottom 0.508: IC2.16 41.91,14.35 44.96,17.4 63.12,17.4 R1.P$2

### Text on the board
tPlace: A IN | IN | A IN | IN | A OUT | LO | HI | OUT | SYNC | EXT SYNC | IN | IN | IN | IN | IN | B IN | HI TENSION VGA MODULATOR 2: VCO + PLL + XOR - OTSOS.NET 2019 | GND | GND | GND | GND | + | IN | EXT SYNC | EXT SYNC | EXT SYNC | EXT SYNC | PLL MOD | B IN | IN | OUT | OUT | OUT | OUT | OUT | B OUT | OUT | OUT | OUT | OUT | PLL OUT | OUT | GND | GND | HSYNC | HSYNC | SYNC | SYNC | VCC | VCC
tNames: + | + | + | +